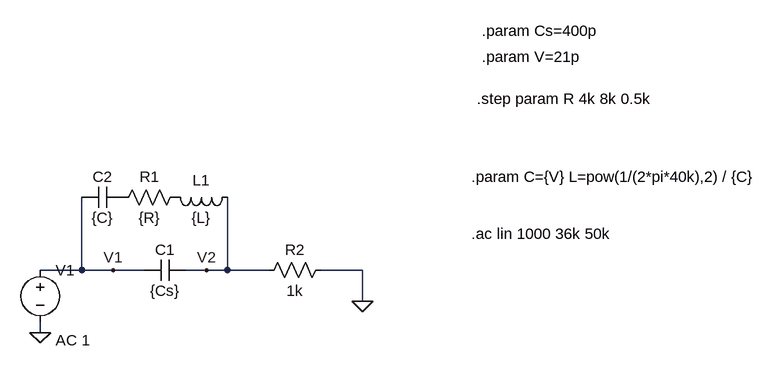
[diagram p0: schematic transducer_characteristics_sweep-r.asc]
transducer_characteristics_sweep-r.asc, the LTspice schematic file:
Version 4
SHEET 1 880 680
WIRE -368 240 -368 128
WIRE -368 240 -432 240
WIRE -320 240 -368 240
WIRE -272 240 -320 240
WIRE -176 240 -208 240
WIRE -144 240 -144 128
WIRE -144 240 -176 240
WIRE -80 240 -144 240
WIRE 64 240 0 240
WIRE 64 288 64 240
WIRE -432 336 -432 320
FLAG 64 288 0
FLAG -432 336 0
FLAG -320 240 V1
FLAG -176 240 V2
SYMBOL cap -208 224 R90
WINDOW 0 0 32 VBottom 2
WINDOW 3 32 32 VTop 2
SYMATTR InstName C1
SYMATTR Value {Cs}
SYMBOL cap -304 112 R90
WINDOW 0 0 32 VBottom 2
WINDOW 3 32 32 VTop 2
SYMATTR InstName C2
SYMATTR Value {C}
SYMBOL res -208 112 R90
WINDOW 0 0 56 VBottom 2
WINDOW 3 32 56 VTop 2
SYMATTR InstName R1
SYMATTR Value {R}
SYMBOL ind -128 112 R90
WINDOW 0 5 56 VBottom 2
WINDOW 3 32 56 VTop 2
SYMATTR InstName L1
SYMATTR Value {L}
SYMBOL res 16 224 R90
WINDOW 0 0 56 VBottom 2
WINDOW 3 32 56 VTop 2
SYMATTR InstName R2
SYMATTR Value 1k
SYMBOL voltage -432 224 R0
WINDOW 123 24 124 Left 2
WINDOW 39 0 0 Left 0
SYMATTR Value2 AC 1
SYMATTR InstName V1
SYMATTR Value ""
TEXT 232 96 Left 2 !.param C={V} L=pow(1/(2*pi*40k),2) / {C}
TEXT 248 -88 Left 2 !.param V=21p
TEXT 240 -24 Left 2 !.step param R 4k 8k 0.5k
TEXT 248 -128 Left 2 !.param Cs=400p
TEXT 232 184 Left 2 !.ac lin 1000 36k 50k

The netlist it stands for:
* transducer_characteristics_sweep-r.asc
C1 V2 V1 {Cs}
C2 P001 V1 {C}
R1 P002 P001 {R}
L1 V2 P002 {L}
R2 0 V2 1k
V1 V1 0 AC 1
.param C={V} L=pow(1/(2*pi*40k),2) / {C}
.param V=21p
.step param R 4k 8k 0.5k
.param Cs=400p
.ac lin 1000 36k 50k
.backanno
.end